# Altium schematic sheet HBridge_Top_Level.SchDoc
size 203 x 127 mm; SheetNumber: 4; SheetTotal: 6
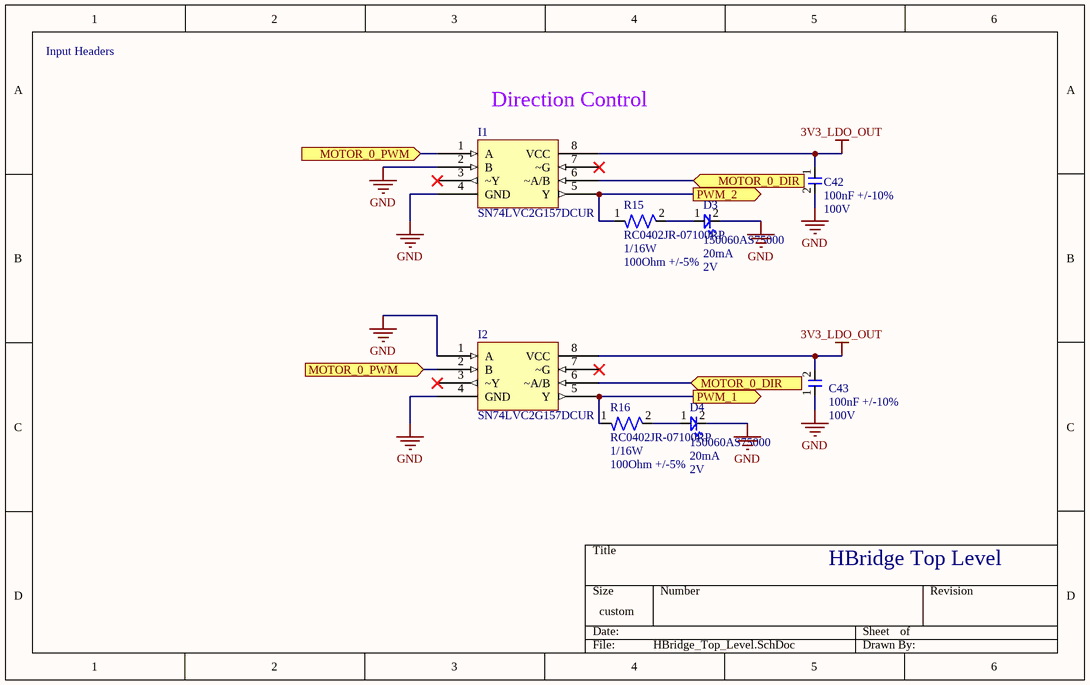
[diagram p0: HBridge_Top_Level.SchDoc]

## Parts
C42  Capacitance: 100nF +/-10%  Voltage Rating: 100V  [CAP-0603]  (hidden comment: CC0603KRX7R0BB104)
C43  Capacitance: 100nF +/-10%  Voltage Rating: 100V  [CAP-0603]  (hidden comment: CC0603KRX7R0BB104)
D3  150060AS75000  Current Rating: 20mA  Vf: 2V  [LED-0603]
D4  150060AS75000  Current Rating: 20mA  Vf: 2V  [LED-0603]
I1  SN74LVC2G157DCUR  [IC-MUX-8VSSOP]
I2  SN74LVC2G157DCUR  [IC-MUX-8VSSOP]
R15  RC0402JR-07100RP  Power Rating: 1/16W  Resistance: 100Ohm +/-5%  [RES-0402]
R16  RC0402JR-07100RP  Power Rating: 1/16W  Resistance: 100Ohm +/-5%  [RES-0402]

## Ports
MOTOR_0_DIR (in, see HBridge_Top_Level[4B], MCU_CAN[4C]), MOTOR_0_DIR (in, see HBridge_Top_Level[4C], MCU_CAN[4C]), MOTOR_0_PWM (in, see HBridge_Top_Level[2A], MCU_CAN[4C]), MOTOR_0_PWM (in, see HBridge_Top_Level[2C], MCU_CAN[4C]), PWM_1 (out, see HBridge_Design[1D]), PWM_2 (out, see HBridge_Design[1D])

## Nets
3V3_LDO_OUT: C42.1 C43.2 I1.8(VCC) I2.8(VCC)
GND: C42.2 C43.1 D3.2 D4.2 I1.2(B) I1.4(GND) I2.1(A) I2.4(GND)
MOTOR_0_DIR: I1.6(~A/B) I2.6(~A/B) ; port MOTOR_0_DIR
MOTOR_0_PWM: I1.1(A) I2.2(B) ; port MOTOR_0_PWM
PWM_1: I2.5(Y) R16.1 ; port PWM_1
PWM_2: I1.5(Y) R15.1 ; port PWM_2
NetD3_1: D3.1 R15.2
NetD4_1: D4.1 R16.2

Not connected (* = marked no-connect by the designer): I1 3(~Y)* 7(~G)*; I2 3(~Y)* 7(~G)*

## Notes on the sheet
- Input Headers
- (near I1) Direction Control
- HBridge Top Level

## Library data of the parts
C42 C43 = CAP-100N-0001: CAP CER 0.1UF 100V X7R 0603; Manufacturer: YAGEO; Assembled?: no; Manufacturer Part Number: CC0603KRX7R0BB104; Temperature Coefficient: X7R; Package Size: 0603
D3 D4 = LED_Amber_0001: CAP CER 0.1UF 100V X7R 0603; Manufacturer: Wurth Electronik; Assembled?: no; Color: Amber; Manufacturer Part Number: 150060AS75000; Package Size: 0603
I1 = IC-MUX-0001
I2 = IC-MUX-0001: Multiplexer 1 x 2:1 8-VSSOP; Vin: 1.65-5.5V
R15 R16 = RES-100-0001: RES SMD 100 OHM 5% 1/16W 0402; Manufacturer: YAGEO; Assembled?: no; Manufacturer Part Number: RC0402JR-07100RP; Package Size: 0402